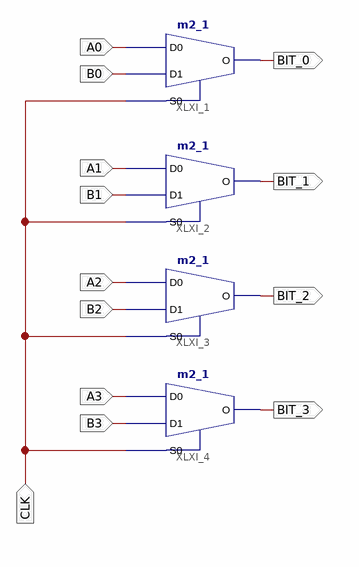
[diagram p0: schematic sheet 1]
// Xilinx ISE schematic Multiplexer.sch (spartan6) as structural Verilog: 4 symbols, 13 ports
module Multiplexer (
  input  CLK,
  input  B3,
  input  A3,
  input  B2,
  input  A2,
  input  B1,
  input  A1,
  input  A0,
  input  B0,
  output BIT_0,
  output BIT_1,
  output BIT_2,
  output BIT_3
);

  m2_1 XLXI_1 (.D0(A0), .D1(B0), .S0(CLK), .O(BIT_0));
  m2_1 XLXI_2 (.D0(A1), .D1(B1), .S0(CLK), .O(BIT_1));
  m2_1 XLXI_3 (.D0(A2), .D1(B2), .S0(CLK), .O(BIT_2));
  m2_1 XLXI_4 (.D0(A3), .D1(B3), .S0(CLK), .O(BIT_3));
endmodule
